# EAGLE design Memory (EAGLE 8.0.0)
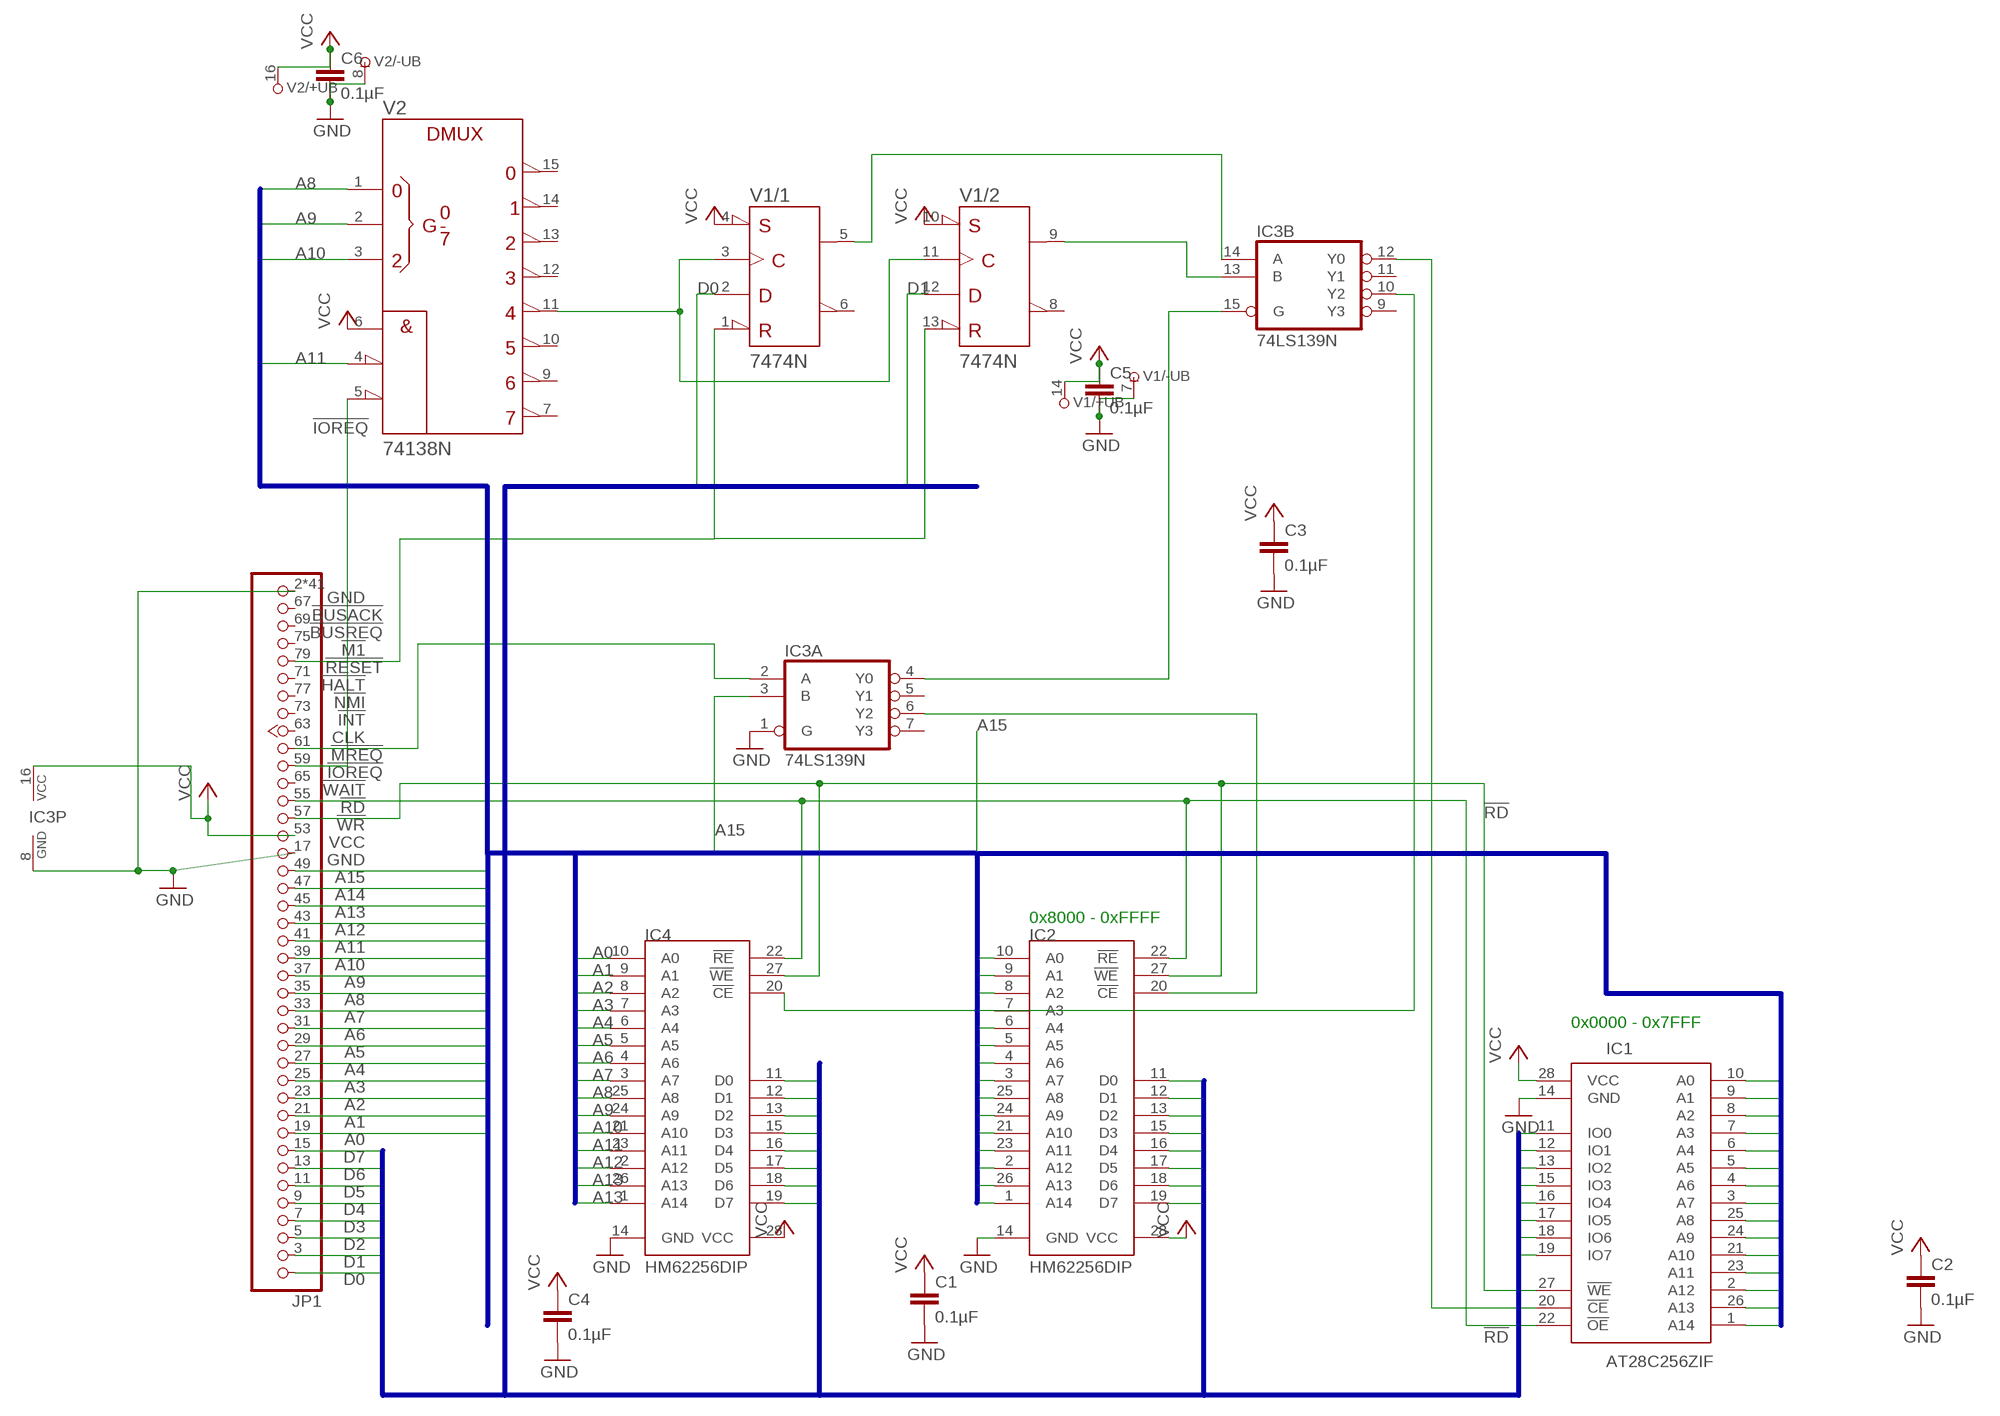
[diagram p0: schematic, sheet 1]

## Parts
C1  0.1µF  C5/2.5  [C5B2.5]
C2  0.1µF  C5/2.5  [C5B2.5]
C3  0.1µF  C5/2.5  [C5B2.5]
C4  0.1µF  C5/2.5  [C5B2.5]
C5  0.1µF  C5/2.5  [C5B2.5]
C6  0.1µF  C5/2.5  [C5B2.5]
IC1  AT28C256ZIF  [DIL28-ZIF]
IC2  HM62256DIP  [HM62256-DIP]
IC3  74LS139N  [DIL16]
IC4  HM62256DIP  [HM62256-DIP]
JP1  JEANNECTOR/90  [2X25/90]
V1  7474N  [DIL14]
V2  74138N  [DIL16]

## Nets
!IOREQ: JP1.59(!IOREQ) V2.5(!G2B)
!MREQ: IC3.2(A:A) JP1.61(!MREQ)
!RD: IC1.22(!OE) IC2.22(!RE) IC4.22(!RE) JP1.55(!RD)
!WR: IC1.27(!WE) IC2.27(!WE) IC4.27(!WE) JP1.57(!WR)
A0: IC1.10(A0) IC2.10(A0) IC4.10(A0) JP1.19(A0)
A1: IC1.9(A1) IC2.9(A1) IC4.9(A1) JP1.21(A1)
A2: IC1.8(A2) IC2.8(A2) IC4.8(A2) JP1.23(A2)
A3: IC1.7(A3) IC2.7(A3) IC4.7(A3) JP1.25(A3)
A4: IC1.6(A4) IC2.6(A4) IC4.6(A4) JP1.27(A4)
A5: IC1.5(A5) IC2.5(A5) IC4.5(A5) JP1.29(A5)
A6: IC1.4(A6) IC2.4(A6) IC4.4(A6) JP1.31(A6)
A7: IC1.3(A7) IC2.3(A7) IC4.3(A7) JP1.33(A7)
A8: IC1.25(A8) IC2.25(A8) IC4.25(A8) JP1.35(A8) V2.1(A)
A9: IC1.24(A9) IC2.24(A9) IC4.24(A9) JP1.37(A9) V2.2(B)
A10: IC1.21(A10) IC2.21(A10) IC4.21(A10) JP1.39(A10) V2.3(C)
A11: IC1.23(A11) IC2.23(A11) IC4.23(A11) JP1.41(A11) V2.4(!G2A)
A12: IC1.2(A12) IC2.2(A12) IC4.2(A12) JP1.43(A12)
A13: IC1.26(A13) IC2.26(A13) IC4.26(A13) JP1.45(A13)
A14: IC1.1(A14) IC2.1(A14) IC4.1(A14) JP1.47(A14)
A15: IC3.3(A:B) JP1.49(A15)
D0: IC1.11(IO0) IC2.11(D0) IC4.11(D0) JP1.1(D0) V1.2(/1:D)
D1: IC1.12(IO1) IC2.12(D1) IC4.12(D1) JP1.3(D1) V1.12(/2:D)
D2: IC1.13(IO2) IC2.13(D2) IC4.13(D2) JP1.5(D2)
D3: IC1.15(IO3) IC2.15(D3) IC4.15(D3) JP1.7(D3)
D4: IC1.16(IO4) IC2.16(D4) IC4.16(D4) JP1.9(D4)
D5: IC1.17(IO5) IC2.17(D5) IC4.17(D5) JP1.11(D5)
D6: IC1.18(IO6) IC2.18(D6) IC4.18(D6) JP1.13(D6)
D7: IC1.19(IO7) IC2.19(D7) IC4.19(D7) JP1.15(D7)
GND: C1.2 C2.2 C3.2 C4.2 C5.2 C6.2 IC1.14(GND) IC2.14(GND) IC3.1(A:G) IC3.8(P:GND) IC4.14(GND) JP1.2(GND) JP1.4(GND) JP1.6(GND) JP1.8(GND) JP1.10(GND) JP1.12(GND) JP1.14(GND) JP1.16(GND) JP1.17(GND) JP1.18(GND) JP1.20(GND) JP1.22(GND) JP1.24(GND) JP1.26(GND) JP1.28(GND) JP1.30(GND) JP1.32(GND) JP1.34(GND) JP1.36(GND) JP1.38(GND) JP1.40(GND) JP1.42(GND) JP1.44(GND) JP1.46(GND) JP1.48(GND) JP1.50(GND) JP1.51(GND) JP1.52(GND) JP1.54(GND) JP1.56(GND) JP1.58(GND) JP1.60(GND) JP1.62(GND) JP1.64(GND) JP1.66(GND) JP1.68(GND) JP1.70(GND) JP1.72(GND) JP1.74(GND) JP1.76(GND) JP1.78(GND) JP1.80(GND) V1.7(/-UB:-UB) V2.8(-UB)
N$1: IC2.20(!CE) IC3.6(A:Y2)
N$2: IC1.20(!CE) IC3.12(B:Y0)
N$3: IC3.14(B:A) V1.5(/1:Q)
N$4: V1.3(/1:CLK) V1.11(/2:CLK) V2.11(Y4)
N$5: IC3.13(B:B) V1.9(/2:Q)
N$6: JP1.79(!RESET) V1.1(/1:!CLR) V1.13(/2:!CLR)
N$7: IC3.4(A:Y0) IC3.15(B:G)
N$9: IC3.10(B:Y2) IC4.20(!CE)
VCC: C1.1 C2.1 C3.1 C4.1 C5.1 C6.1 IC1.28(VCC) IC2.28(VCC) IC3.16(P:VCC) IC4.28(VCC) JP1.53(VCC) V1.4(/1:!PRE) V1.10(/2:!PRE) V1.14(/+UB:+UB) V2.6(G1) V2.16(+UB)
Unconnected: IC3.5(A:Y1) IC3.7(A:Y3) IC3.9(B:Y3) IC3.11(B:Y1) JP1.63(CLK) JP1.65(!WAIT) JP1.67(!BUSACK) JP1.69(!BUSRQ) JP1.71(!HALT) JP1.73(!INT) JP1.75(!M1) JP1.77(!NMI) V1.6(/1:!Q) V1.8(/2:!Q) V2.7(Y7) V2.9(Y6) V2.10(Y5) V2.12(Y3) V2.13(Y2) V2.14(Y1) V2.15(Y0)

## Buses
A[0..15]
D[0..7]

## Notes on the sheet
- 0x8000 - 0xFFFF
- 0x0000 - 0x7FFF

## Library data of the parts
C1-C6 = capacitor-wima:C: CAPACITOR naming: grid - package width
IC1 = bt_memory:AT28C256: EEPROM 32Kx8 256k bit The AT28C256 is a high-performance Electrically Erasable and Programmable Read Only Memory. Its 256K of memory is organized as 32,768 words by 8 bits.
IC2 IC4 = jean:HM62256: The HM62256 is a high performance, high speed and super low power CMOS Static Random Access Memory organized as 32,768 words by 8bits and operates for a single 4.5 to 5.5V supply voltage. Advanced CMOS technology and circuit techniques provide both high speed, super low power features and maximum access time of 55/70ns in 5.0V operation. Easy memory expansion is provided by an active LOW chip enable (/CE) and active LOW output enable (/OE). The HM62256 has an automatic power down feature, reducing the power consumption significantly when chip is deselected. The HM62256 is available in JEDEC standard 28-pin SOP (330 mil) and PDIP (600 mil) packages.; OC_FARNELL: unknown
IC3 = 74xx-eu:74*139: Dual 2-line to 4-line DECODER/DEMULTIPLEXER
JP1 = jean:JEANNECTOR: PIN HEADER
V1 = 74ttl-din:74*74: Dual D type positive edge triggered FLIP FLOP, preset and clear
V2 = 74ttl-din:74*138: 3-line to 8-line DECODER/DEMULTIPLEXER

## Board
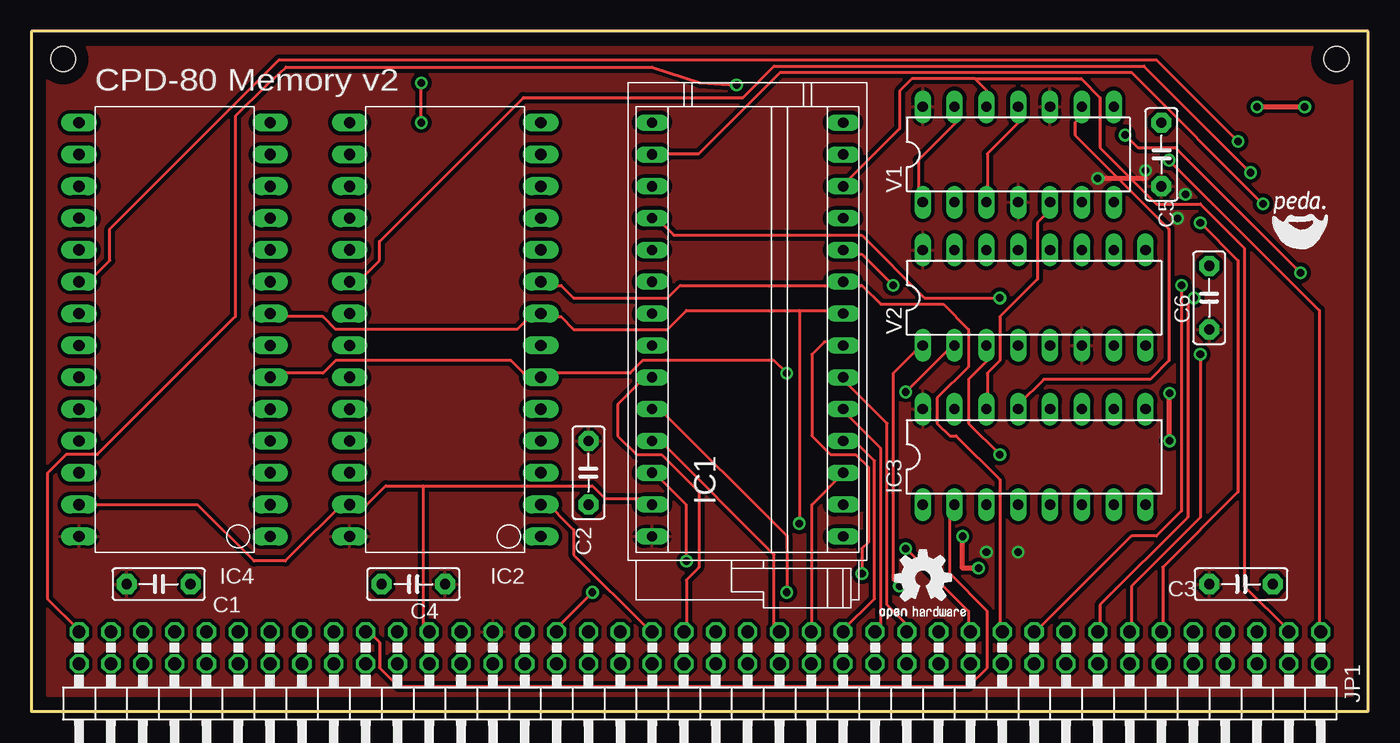
[diagram p1: board, top side]
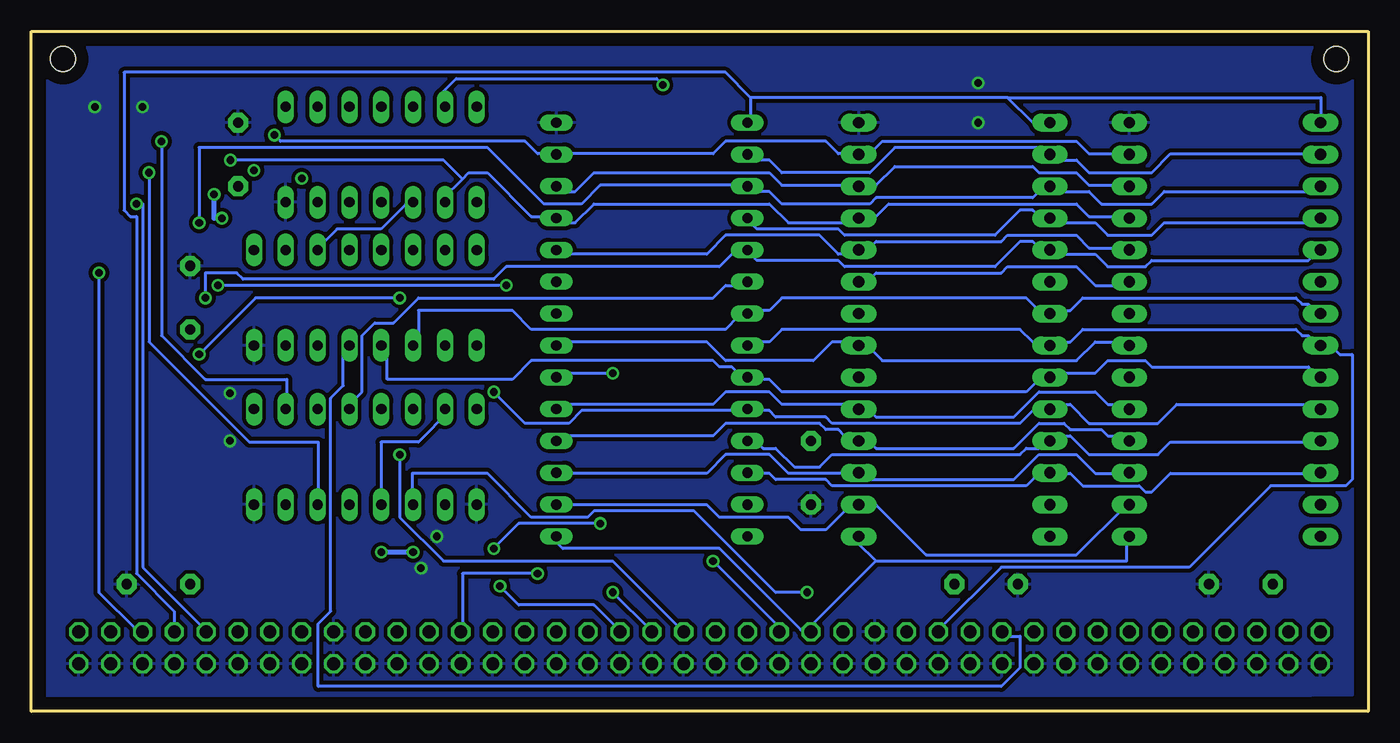
[diagram p2: board, bottom side, seen from below]

Size 106.66 x 54.28 mm. Coordinates in mm from the lower left corner, seen from the top.
Outline: 0,0 106.66,0 106.66,54.28 0,54.28 0,0
Copper layers (1*16): Top 0.035mm / dielectric 1.5mm / Bottom 0.035mm
Design rules "default": minimum track width 10mil, minimum drill 24mil, track to track 8mil, track to pad 8mil, pad to pad 8mil, via to via 8mil, smd to smd 8mil, copper to edge 40mil, drill to drill 8mil, minimum pad ring 10mil, minimum via ring 8mil, stop-mask expansion 4mil, vias tented up to drill 0mil, thermal gap 10mil
Holes 2 mm at 2.54,52.07 104.14,52.07

### Footprints (pad centres in the part's own frame; a part is rotated, then mirrored left to right if it is on the bottom)
C5B2.5 = drill 0.813 pad 1.6 octagon: 1 -2.54,0; 2 2.54,0
DIL28-ZIF = drill 0.813 long: 1 -16.51,-7.62; 2 -13.97,-7.62; 3 -11.43,-7.62; 4 -8.89,-7.62; 5 -6.35,-7.62; 6 -3.81,-7.62; 7 -1.27,-7.62; 8 1.27,-7.62; 9 3.81,-7.62; 10 6.35,-7.62; 11 8.89,-7.62; 12 11.43,-7.62; 13 13.97,-7.62; 14 16.51,-7.62; 15 16.51,7.62; 16 13.97,7.62; 17 11.43,7.62; 18 8.89,7.62; 19 6.35,7.62; 20 3.81,7.62; 21 1.27,7.62; 22 -1.27,7.62; 23 -3.81,7.62; 24 -6.35,7.62; 25 -8.89,7.62; 26 -11.43,7.62; 27 -13.97,7.62; 28 -16.51,7.62
HM62256-DIP = drill 0.9 pad 1.422 long: 1 -8.89,-2.54; 2 -6.35,-2.54; 3 -3.81,-2.54; 4 -1.27,-2.54; 5 1.27,-2.54; 6 3.81,-2.54; 7 6.35,-2.54; 8 8.89,-2.54; 9 11.43,-2.54; 10 13.97,-2.54; 11 16.51,-2.54; 12 19.05,-2.54; 13 21.59,-2.54; 14 24.13,-2.54; 15 24.13,12.7; 16 21.59,12.7; 17 19.05,12.7; 18 16.51,12.7; 19 13.97,12.7; 20 11.43,12.7; 21 8.89,12.7; 22 6.35,12.7; 23 3.81,12.7; 24 1.27,12.7; 25 -1.27,12.7; 26 -3.81,12.7; 27 -6.35,12.7; 28 -8.89,12.7
DIL16 = drill 0.813 long: 1 -8.89,-3.81; 2 -6.35,-3.81; 3 -3.81,-3.81; 4 -1.27,-3.81; 5 1.27,-3.81; 6 3.81,-3.81; 7 6.35,-3.81; 8 8.89,-3.81; 9 8.89,3.81; 10 6.35,3.81; 11 3.81,3.81; 12 1.27,3.81; 13 -1.27,3.81; 14 -3.81,3.81; 15 -6.35,3.81; 16 -8.89,3.81
2X25/90 = drill 1.016 octagon: 1 -29.21,-6.35; 2 -29.21,-3.81; 3 -26.67,-6.35; 4 -26.67,-3.81; 5 -24.13,-6.35; 6 -24.13,-3.81; 7 -21.59,-6.35; 8 -21.59,-3.81; 9 -19.05,-6.35; 10 -19.05,-3.81; 11 -16.51,-6.35; 12 -16.51,-3.81; 13 -13.97,-6.35; 14 -13.97,-3.81; 15 -11.43,-6.35; 16 -11.43,-3.81; 17 -8.89,-6.35; 18 -8.89,-3.81; 19 -6.35,-6.35; 20 -6.35,-3.81; 21 -3.81,-6.35; 22 -3.81,-3.81; 23 -1.27,-6.35; 24 -1.27,-3.81; 25 1.27,-6.35; 26 1.27,-3.81; 27 3.81,-6.35; 28 3.81,-3.81; 29 6.35,-6.35; 30 6.35,-3.81; 31 8.89,-6.35; 32 8.89,-3.81; 33 11.43,-6.35; 34 11.43,-3.81; 35 13.97,-6.35; 36 13.97,-3.81; 37 16.51,-6.35; 38 16.51,-3.81; 39 19.05,-6.35; 40 19.05,-3.81; 41 21.59,-6.35; 42 21.59,-3.81; 43 24.13,-6.35; 44 24.13,-3.81; 45 26.67,-6.35; 46 26.67,-3.81; 47 29.21,-6.35; 48 29.21,-3.81; 49 31.75,-6.35; 50 31.75,-3.81; 51 34.29,-6.35; 52 34.29,-3.81; 53 36.83,-6.35; 54 36.83,-3.81; 55 39.37,-6.35; 56 39.37,-3.81; 57 41.91,-6.35; 58 41.91,-3.81; 59 44.45,-6.35; 60 44.45,-3.81; 61 46.99,-6.35; 62 46.99,-3.81; 63 49.53,-6.35; 64 49.53,-3.81; 65 52.07,-6.35; 66 52.07,-3.81; 67 54.61,-6.35; 68 54.61,-3.81; 69 57.15,-6.35; 70 57.15,-3.81; 71 59.69,-6.35; 72 59.69,-3.81; 73 62.23,-6.35; 74 62.23,-3.81; 75 64.77,-6.35; 76 64.77,-3.81; 77 67.31,-6.35; 78 67.31,-3.81; 79 69.85,-6.35; 80 69.85,-3.81
DIL14 = drill 0.813 long: 1 -7.62,-3.81; 2 -5.08,-3.81; 3 -2.54,-3.81; 4 0,-3.81; 5 2.54,-3.81; 6 5.08,-3.81; 7 7.62,-3.81; 8 7.62,3.81; 9 5.08,3.81; 10 2.54,3.81; 11 0,3.81; 12 -2.54,3.81; 13 -5.08,3.81; 14 -7.62,3.81

### Placement (x,y rotation side)
C1  10.16,10.16 0 top
C2  44.45,19.05 270 top
C3  96.52,10.16 0 top
C4  30.48,10.16 180 top
C5  90.17,44.45 90 top
C6  93.98,33.02 90 top
IC1  57.15,30.48 90 top
IC2  38.1,22.86 90 top
IC3  80.01,20.32 0 top
IC4  16.51,22.86 90 top
JP1  73.66,0 180 top
U$1  [OSHW2]  67.31,6.35 0 top
V1  78.74,44.45 0 top
V2  80.01,33.02 0 top

### Tracks (layer width: path | path; a pad name or v marks a point on that pad's centre or on a via)
!IOREQ
  Bottom 0.254: V2.5 81.77,29 81.77,26 82.77,25 82.77,8 83.77,7 83.77,2 29.27,2 27.77,3.5 27.77,6 28.77,6 JP1.59
!MREQ
  Top 0.254: IC3.2 73.27,16.5 73.27,11 76.27,8 76.27,3.5 74.77,2 29.27,2 27.77,3.5 27.77,5.5 26.77,6.5 JP1.61
!RD
  Bottom 0.254: IC1.22 49.27,29.5 47.77,29.5 46.77,30.5 27.77,30.5 26.77,29.5 25.77,29.5 IC2.22 25.27,29.5 23.77,29.5 22.77,30.5 5.77,30.5 5.27,30 4.77,30 4.27,29.5 IC4.22 3.77,29 2.77,29 2.27,28.5 1.27,28.5 1.27,18.5 1.77,18 7.77,18 14.27,11.5 29.27,11.5 34.27,6.5 JP1.55
!WR
  Top 0.254: 31.27,18 28.27,18 26.77,16.5 25.77,16.5 IC2.27 25.27,17 20.27,12 17.77,12 13.27,16.5 4.27,16.5 IC4.27 | 31.27,18 44.77,18 45.77,17 49.27,17 IC1.27 | 31.27,18 31.27,6.5 JP1.57
A0  (via drill 0.61)
  Top 0.254: v91.77,34 91.77,16 89.77,14 87.77,14 80.27,6.5 JP1.19 | v68.77,34 66.27,36.5 64.77,36.5 IC1.10
  Bottom 0.254: IC1.10 64.77,36.5 52.77,36.5 51.27,38 43.77,38 42.27,36.5 40.77,36.5 IC2.10 40.27,37 39.77,37 39.27,37.5 29.27,37.5 28.77,38 23.27,38 22.27,37 19.27,37 IC4.10 | v68.77,34 v91.77,34
A1
  Top 0.254: 64.77,34 51.77,34 50.77,33 43.27,33 42.27,34 40.77,34 IC2.9 | 64.77,34 66.27,34 67.77,32.5 72.77,32.5 74.77,30.5 74.77,27.5 72.27,25 72.27,23 73.27,22 73.77,22 77.27,18.5 77.27,6.5 JP1.21 | 64.77,34 IC1.9
  Bottom 0.254: IC4.9 19.27,34 21.77,34 23.27,35.5 28.77,35.5 29.27,35 39.27,35 39.77,34.5 40.27,34.5 IC2.9
A2  (via drill 0.61)
  Top 0.254: 61.27,32 52.27,32 50.77,30.5 43.27,30.5 42.27,31.5 40.77,31.5 IC2.8 40.27,32 38.77,30.5 24.27,30.5 23.27,31.5 19.27,31.5 IC4.8 | 61.27,32 64.77,32 IC1.8 | v69.77,13 74.77,8 74.77,6.5 JP1.23 | 61.27,32 v61.27,15
  Bottom 0.254: v69.77,13 67.77,15 v61.27,15
A3  (via drill 0.61)
  Top 0.254: v66.27,11 66.27,13 66.77,13.5 66.77,19.5 65.77,20.5 63.77,20.5 62.27,22 62.27,28.5 63.27,29.5 64.77,29.5 IC1.7
  Bottom 0.254: IC1.7 64.77,29.5 52.77,29.5 51.27,28 44.27,28 42.77,29.5 40.77,29.5 IC2.7 40.27,29 39.77,29 38.77,28 23.27,28 21.77,29.5 19.27,29.5 IC4.7 | v66.27,11 72.27,11 72.27,6.5 JP1.25
A4  (via drill 0.61)
  Top 0.254: IC4.6 19.27,27 23.27,27 24.27,28 38.27,28 39.27,27 40.27,27 IC2.6 40.77,27 47.77,27 48.77,28 59.27,28 v60.27,27 | IC1.6 64.77,26.5 68.27,23 68.27,8.5 70.27,6.5 JP1.27
  Bottom 0.254: v60.27,27 64.77,27 IC1.6
A5
  Top 0.254: IC1.5 64.77,24 67.77,21 67.77,6.5 JP1.29
  Bottom 0.254: IC4.5 19.27,24.5 20.77,24.5 21.77,25.5 26.27,25.5 28.27,23.5 39.27,23.5 39.77,24 40.27,24 IC2.5 40.77,24.5 46.77,24.5 47.77,25.5 51.27,25.5 52.27,24.5 64.77,24.5 IC1.5
A6
  Top 0.254: IC1.4 64.77,21.5 65.77,21.5 67.27,20 67.27,9 64.77,6.5 JP1.31
  Bottom 0.254: IC4.4 19.27,22 20.77,22 21.27,22.5 23.77,22.5 24.27,23 26.27,23 28.27,21 39.27,21 39.77,21.5 40.27,21.5 IC2.4 40.77,22 41.77,22 42.27,22.5 43.27,22.5 43.77,23 51.27,23 52.27,22 64.77,22 IC1.4
A7
  Top 0.254: IC1.3 64.77,19 62.27,16.5 62.27,6.5 JP1.33
  Bottom 0.254: IC4.3 19.27,19 21.77,19 23.27,20.5 26.27,20.5 28.27,18.5 39.77,18.5 40.27,19 IC2.3 40.77,19 46.27,19 47.77,20.5 51.27,20.5 52.77,19 64.77,19 IC1.3
A8  (via drill 0.61)
  Top 0.254: IC1.25 49.77,21.5 50.27,21.5 59.27,12.5 59.27,6.5 JP1.35 | v69.27,10 68.77,10.5 68.77,27 70.77,29 V2.1
  Bottom 0.254: IC4.25 4.27,21.5 15.77,21.5 16.77,20.5 22.27,20.5 23.77,22 25.27,22 IC2.25 25.77,21.5 26.27,21 27.27,21 27.77,20.5 42.77,20.5 43.77,19.5 45.77,19.5 47.27,21 48.27,21 48.77,21.5 49.27,21.5 IC1.25 | v69.27,10 67.77,8.5 61.77,8.5 59.77,6.5 JP1.35
A9  (via drill 0.61)
  Top 0.254: v69.77,25.5 73.27,29 V2.2 | v60.27,9.5 60.27,14 49.77,24.5 IC1.24
  Bottom 0.254: v69.77,25.5 67.27,23 63.77,23 62.77,24 49.77,24 IC1.24 49.27,24 47.77,24 47.27,23.5 43.27,23.5 42.77,23 27.77,23 26.77,24 25.77,24 IC2.24 25.27,24.5 23.77,24.5 22.27,23 16.77,23 15.27,24.5 4.27,24.5 IC4.24 | v60.27,9.5 57.27,6.5 JP1.37
A10  (via drill 0.61)
  Top 0.254: v77.27,20.5 74.77,23 74.77,26.5 76.27,28 76.27,29 V2.3
  Bottom 0.254: V2.3 75.77,29.5 75.77,32 68.27,32 66.77,30.5 51.27,30.5 50.27,31.5 49.77,31.5 IC1.21 49.27,32 47.77,32 46.77,33 27.27,33 26.27,32 25.77,32 IC2.21 25.27,32 23.77,32 22.77,33 5.77,33 5.27,32.5 4.77,32.5 4.27,32 IC4.21 | v77.27,20.5 77.27,15.5 73.77,12 60.27,12 54.77,6.5 JP1.39
A11
  Top 0.254: JP1.41 52.27,6.5 52.27,10.5 53.27,11.5 53.27,17.5 50.27,20.5 48.27,20.5 46.77,22 46.77,24.5 49.27,27 IC1.23
  Bottom 0.254: V2.4 78.27,29 78.27,26.5 68.27,26.5 66.77,28 52.27,28 51.77,27.5 50.77,27.5 50.27,27 49.77,27 IC1.23 49.27,26.5 47.77,26.5 46.77,25.5 27.27,25.5 26.27,26.5 25.77,26.5 IC2.23 25.27,27 21.77,27 20.77,28 17.77,28 17.27,27.5 4.77,27.5 4.27,27 IC4.23
A12
  Top 0.254: JP1.43 49.27,6.5 43.27,12.5 43.27,14.5 40.77,17 IC2.2
  Bottom 0.254: IC1.2 52.77,16.5 51.77,15.5 46.27,15.5 45.27,14.5 43.27,14.5 41.27,16.5 40.77,16.5 IC2.2 40.27,16.5 39.27,16.5 35.27,12.5 23.27,12.5 19.27,16.5 IC4.2
A13  (via drill 0.61)
  Top 0.254: v52.27,12 52.27,16.5 49.77,19 IC1.26
  Bottom 0.254: v52.27,12 46.77,6.5 JP1.45 | IC4.26 4.27,19 15.77,19 17.27,17.5 17.77,17.5 18.27,18 22.77,18 23.77,19 25.27,19 IC2.26 25.77,19 26.27,19 27.27,18 42.77,18 43.27,18.5 47.27,18.5 47.77,19 49.27,19 IC1.26
A14
  Bottom 0.254: 39.27,12 19.27,12 19.27,13.5 IC4.1 | 39.27,12 40.77,13.5 IC2.1 | 44.77,6.5 45.27,6.5 51.77,13 64.27,13 64.77,13.5 IC1.1 | 44.77,6.5 39.27,12 | 44.77,6.5 JP1.47
A15  (via drill 0.61)
  Top 0.254: v44.77,9.5 41.77,6.5 JP1.49
  Bottom 0.254: v44.77,9.5 47.27,9.5 53.77,16 61.77,16 62.27,15.5 66.77,15.5 70.27,19 76.27,19 76.27,17 IC3.3
D0  (via drill 0.61)
  Top 0.254: v90.77,44 102.77,32 102.77,6.5 JP1.1
  Bottom 0.254: IC4.11 19.27,39.5 22.27,39.5 23.27,40.5 38.27,40.5 39.27,39.5 40.27,39.5 IC2.11 40.77,39 46.27,39 47.77,40.5 61.77,40.5 63.27,39 64.77,39 IC1.11 64.77,39.5 66.77,39.5 70.27,43 71.77,43 72.27,42.5 | 72.27,42.5 73.77,41 V1.2 | v90.77,44 73.77,44 72.27,42.5
D1
  Top 0.254: 75.27,50.5 70.27,50.5 69.27,49.5 69.27,46.5 64.77,42 IC1.12 | 75.27,50.5 76.27,49.5 76.27,48.5 V1.12 | 75.27,50.5 83.77,50.5 85.27,49 85.27,45 89.77,40.5 93.27,40.5 96.77,37 96.77,10 100.27,6.5 JP1.3
  Bottom 0.254: IC4.12 19.27,42 22.27,42 23.27,43 26.27,43 26.77,43.5 37.77,43.5 39.27,42 40.27,42 IC2.12 40.77,42 46.77,42 47.77,43 61.77,43 63.27,41.5 64.77,41.5 IC1.12
D2  (via drill 0.61)
  Top 0.254: v101.27,35 91.27,45 88.27,45 v87.27,46
  Bottom 0.254: 64.77,44.5 52.27,44.5 51.27,45.5 43.27,45.5 42.27,44.5 40.77,44.5 IC2.13 40.27,44.5 39.77,44.5 38.77,45.5 23.27,45.5 22.27,44.5 19.27,44.5 IC4.13 | v101.27,35 101.27,9.5 98.27,6.5 JP1.5 | v87.27,46 86.77,45.5 67.27,45.5 66.27,44.5 64.77,44.5 | 64.77,44.5 IC1.13
D3
  Bottom 0.254: 49.27,49 49.27,47 IC1.15 | 28.77,49 49.27,49 | 28.77,49 26.77,47 25.77,47 IC2.15 | 28.77,49 3.77,49 3.77,47 IC4.15 | 49.27,49 51.27,51 99.27,51 99.27,40 98.77,39.5 98.27,39.5 98.27,11 95.27,8 95.27,6.5 JP1.7
D4  (via drill 0.61)
  Top 0.254: v98.27,40.5 87.77,51 59.77,51 53.27,44.5 49.77,44.5 IC1.16
  Bottom 0.254: IC1.16 49.27,44 47.77,44 46.77,43 39.77,43 37.77,45 26.27,45 25.77,44.5 IC2.16 25.27,44 23.27,44 22.27,43 17.27,43 15.77,44.5 4.27,44.5 IC4.16 | v98.27,40.5 97.77,40.5 97.77,11.5 92.77,6.5 JP1.9
D5  (via drill 0.61)
  Top 0.254: v93.27,39 96.27,36 96.27,17.5 90.27,11.5 90.27,6.5 JP1.11
  Bottom 0.254: IC4.17 4.27,41.5 16.27,41.5 17.27,40.5 21.27,40.5 22.27,41.5 25.27,41.5 IC2.17 25.77,41.5 26.27,41.5 26.77,41 39.27,41 39.77,40.5 46.77,40.5 47.77,41.5 49.27,41.5 IC1.17 49.77,42 61.27,42 62.77,40.5 65.77,40.5 70.27,45 93.27,45 v93.27,39
D6  (via drill 0.61)
  Top 0.254: v93.27,28.5 93.27,15.5 87.77,10 87.77,6.5 JP1.13 | v77.27,33 71.27,33 66.27,38 51.27,38 49.77,39.5 IC1.18
  Bottom 0.254: IC1.18 49.27,39 48.77,38.5 42.27,38.5 41.77,38 29.77,38 27.77,40 26.77,40 26.27,39.5 25.77,39.5 IC2.18 25.27,39 21.77,39 20.77,38 17.27,38 16.27,39 4.27,39 IC4.18 | v93.27,28.5 88.77,33 v77.27,33
D7  (via drill 0.61)
  Top 0.254: v92.77,33 92.27,32.5 92.27,15.5 85.27,8.5 85.27,6.5 JP1.15
  Bottom 0.254: IC4.19 4.27,36.5 4.77,36 17.27,36 17.77,35.5 20.77,35.5 21.77,36.5 25.27,36.5 IC2.19 25.77,37 26.27,37 26.77,37.5 27.77,37.5 29.77,35.5 41.77,35.5 42.27,36 48.77,36 49.27,36.5 IC1.19 49.77,36.5 50.77,36.5 51.77,35.5 68.77,35.5 69.77,34.5 89.77,34.5 90.27,35 92.77,35 v92.77,33
GND  (via drill 0.6)
  Top 0.254: v31.11,46.99 v31.11,50.16
  Top 0.406: v75.56,11.43 74.3,11.43 v74.3,13.97 | v97.79,48.26 v101.6,48.26 | v90.8,21.59 v90.8,25.4
  pour Bottom (isolate 0.305): 1.27,53.34 1.27,1.27 105.41,0 105.41,53.34
N$1  (via drill 0.61)
  Top 0.254: v97.27,43 88.77,51.5 59.27,51.5 56.77,49 39.27,49 27.77,37.5 27.77,36 25.77,34 IC2.20
  Bottom 0.254: v97.27,43 97.27,29.5 89.27,21.5 83.77,21.5 83.77,17 IC3.6
N$2
  Bottom 0.254: IC1.20 49.77,34 51.27,34 52.27,33 75.77,33 77.77,31 79.27,31 80.27,30 80.27,25.5 81.27,24.5 IC3.12
N$3
  Top 0.254: IC3.14 76.27,24.5 76.27,27 77.27,28 77.27,31.5 80.27,34.5 80.27,39 81.77,40.5 V1.5
N$4
  Top 0.254: V1.3 76.27,41 76.27,44.5 78.77,47 78.77,48 V1.11
  Bottom 0.254: V2.11 83.77,37 82.27,38.5 78.77,38.5 76.77,40.5 76.27,40.5 V1.3
N$5
  Top 0.254: IC3.13 78.77,24.5 80.77,26.5 89.27,26.5 90.77,28 90.77,38.5 83.27,46 83.27,47 84.27,48 V1.9
N$6  (via drill 0.61)
  Top 0.254: V1.1 70.77,41 70.77,44 73.77,47 73.77,48 V1.13 | JP1.79 3.77,6.5 1.27,9 1.27,19 2.77,20.5 5.27,20.5 16.27,31.5 16.27,47.5 18.77,50 20.32,51.44 49.53,51.44 53.34,50.16 v56.27,50
  Bottom 0.254: v56.27,50 56.77,50.5 72.77,50.5 73.77,49.5 73.77,48.5 V1.13
N$7
  Bottom 0.254: IC3.4 78.77,17 78.77,21.5 75.77,21.5 73.27,24 IC3.15
N$9  (via drill 0.61)
  Top 0.254: v96.27,45.5 89.77,52 19.77,52 6.27,38.5 6.27,36 4.27,34 IC4.20
  Bottom 0.254: v96.27,45.5 96.27,30 92.77,26.5 86.27,26.5 86.27,24.5 IC3.10
VCC  (via drill 0.6)
  Top 0.406: v85.09,42.55 88.9,42.55 v88.9,43.18
  Bottom 0.406: v91.44,39.37 92.08,39.37 v92.08,41.27 | v76.2,12.7 v78.74,12.7
  pour Top (isolate 0.305): 1.27,53.34 1.27,1.27 105.41,1.27 105.41,53.34

### Text on the board
tPlace: CPD-80 Memory v2